# EAGLE design Bus Stop Kiosk Rev. 1 (EAGLE 7.3.0)
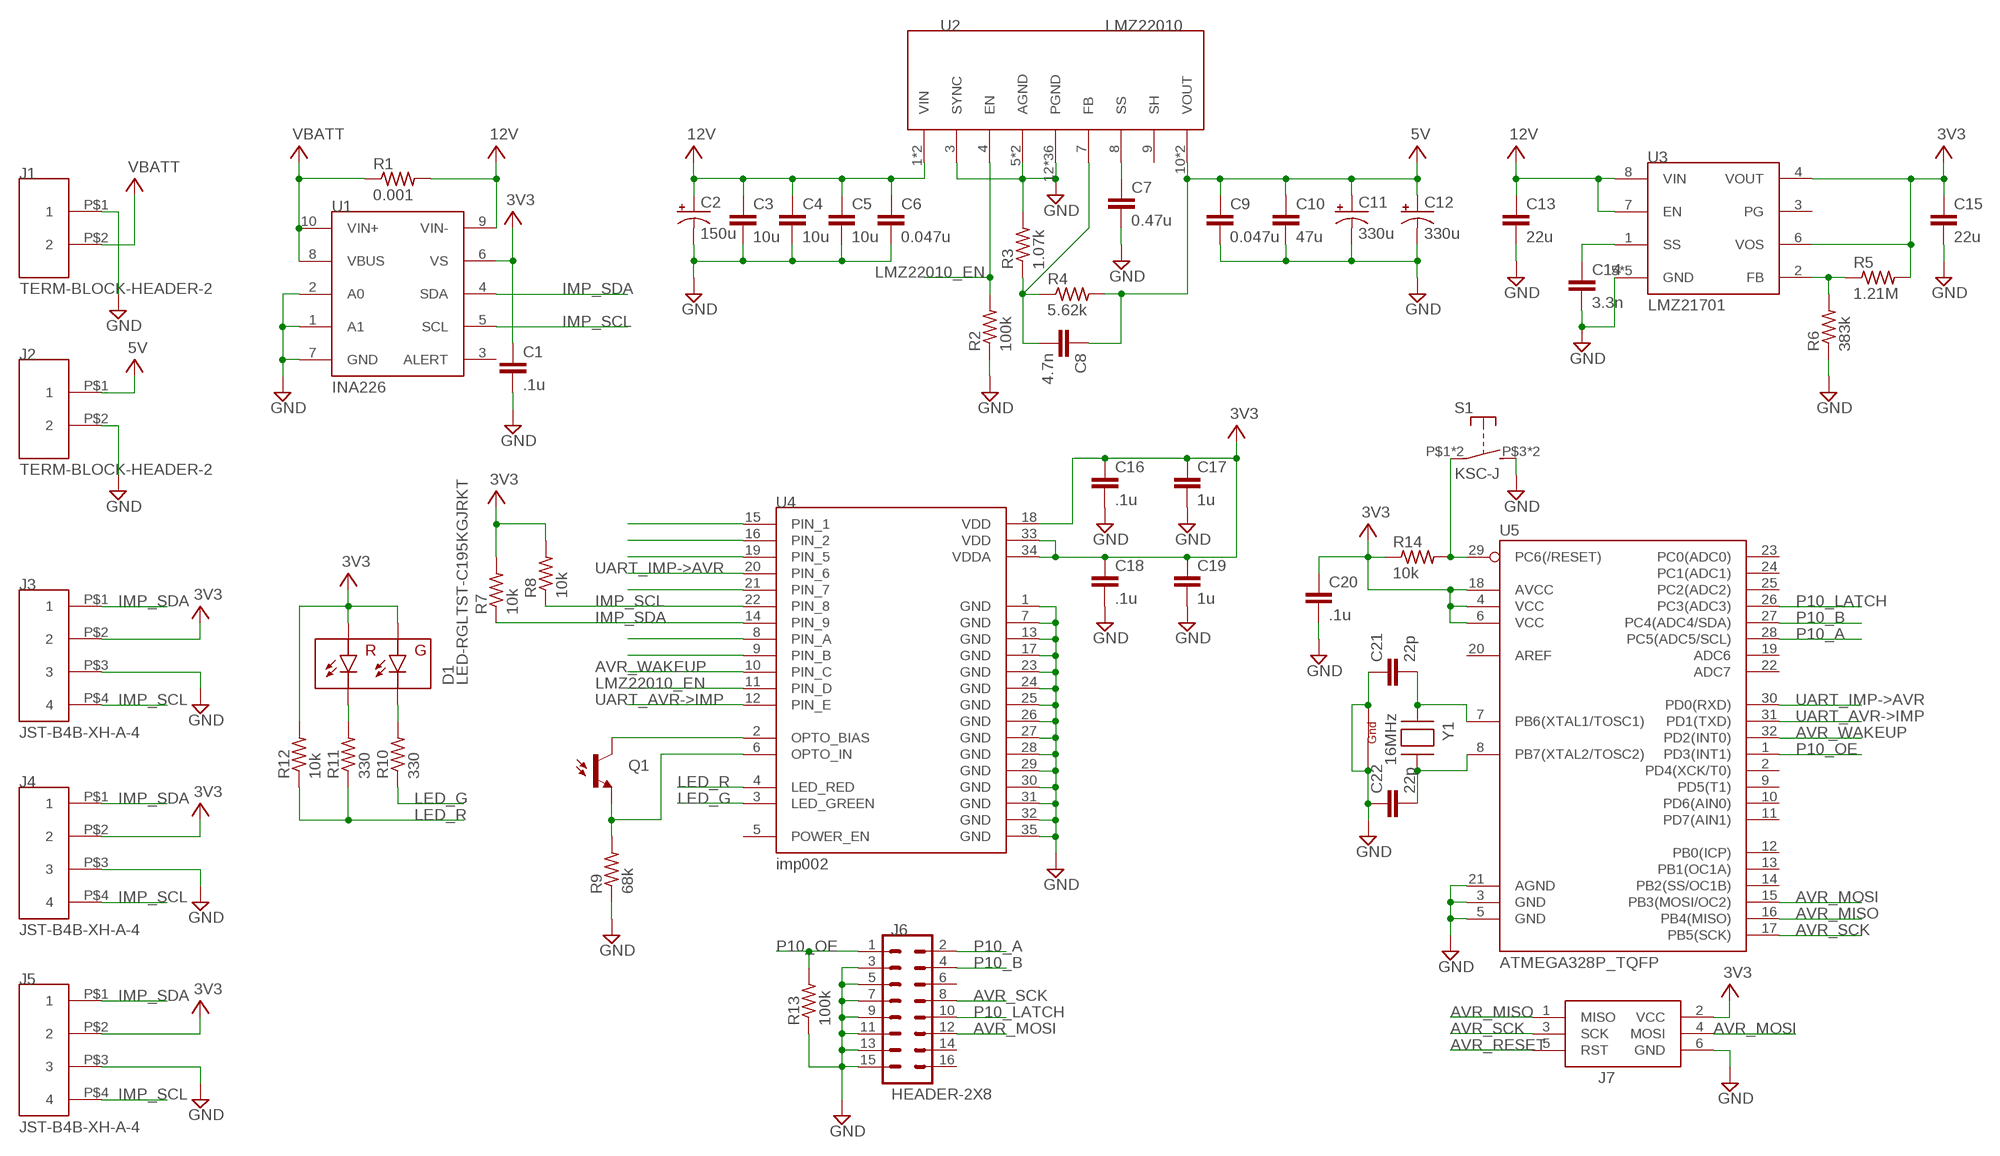
[diagram p0: schematic, sheet 1]

## Parts
C1  .1u  C-EUC0603K  [C0603K]
C2  150u  CAP_POLG  [PANASONIC_G]
C3  10u  C-EUC1210K  [C1210K]
C4  10u  C-EUC1210K  [C1210K]
C5  10u  C-EUC1210K  [C1210K]
C6  0.047u  C-EUC1206K  [C1206K]
C7  0.47u  C-EUC0603K  [C0603K]
C8  4.7n  C-EUC0603K  [C0603K]
C9  0.047u  C-EUC1206K  [C1206K]
C10  47u  C-EUC1210K  [C1210K]
C11  330u  CAP_POL7343  [EIA7343]
C12  330u  CAP_POL7343  [EIA7343]
C13  22u  C-EUC1210K  [C1210K]
C14  3.3n  C-EUC0603K  [C0603K]
C15  22u  C-EUC0805K  [C0805K]
C16  .1u  C-EUC0603K  [C0603K]
C17  1u  C-EUC0603K  [C0603K]
C18  .1u  C-EUC0603K  [C0603K]
C19  1u  C-EUC0603K  [C0603K]
C20  .1u  C-EUC0603K  [C0603K]
C21  22p  C-EUC0603K  [C0603K]
C22  22p  C-EUC0603K  [C0603K]
D1  LED-RGLTST-C195KGJRKT  [LTST-C195KGJRKT]
J1  TERM-BLOCK-HEADER-2  [TERM-BLOCK-HDR-2]
J2  TERM-BLOCK-HEADER-2  [TERM-BLOCK-HDR-2]
J3  JST-B4B-XH-A-4  [JST-B4B-XH-A-4]
J4  JST-B4B-XH-A-4  [JST-B4B-XH-A-4]
J5  JST-B4B-XH-A-4  [JST-B4B-XH-A-4]
J6  HEADER-2X8  [HEADER-2X8-SHROUDED]
J7  AVRISP-6  [AVRISP]
Q1  PHOTOTRANSISTORPT17-21C-L41-TR8  [PT17-21C-L41-TR8]
R1  0.001  R-US_R1206  [R1206]
R2  100k  R-US_R0603  [R0603]
R3  1.07k  R-US_R0603  [R0603]
R4  5.62k  R-US_R0603  [R0603]
R5  1.21M  R-US_R0603  [R0603]
R6  383k  R-US_R0603  [R0603]
R7  10k  R-US_R0603  [R0603]
R8  10k  R-US_R0603  [R0603]
R9  68k  R-US_R0603  [R0603]
R10  330  R-US_R0603  [R0603]
R11  330  R-US_R0603  [R0603]
R12  10k  R-US_R0603  [R0603]
R13  100k  R-US_R0603  [R0603]
R14  10k  R-US_R0603  [R0603]
S1  KSC-J  [C&K-KSC]
U1  INA226  [VSSOP-10]
U2  LMZ22010  [TO-PMOD-11]
U3  LMZ21701  [SIL0008E]
U4  imp002  ELECTRIC_IMP_IMP002  [ELECTRIC_IMP_IMP002]
U5  ATMEGA328P_TQFP  [TQFP32-08]
Y1  16MHz  XTAL-4-3225  [NX3225]

## Nets
3V3: C1.1 C15.1 C16.1 C17.1 C18.1 C19.1 C20.1 D1.P$1(GA) D1.P$2(RA) J3.P$2 J4.P$2 J5.P$2 J7.2(VCC) R5.2 R7.2 R8.2 R12.2 R14.1 U1.6(VS) U3.4(VOUT) U3.6(VOS) U4.18(VDD) U4.33(VDD) U4.34(VDDA) U5.4(VCC) U5.6(VCC) U5.18(AVCC)
5V: C8.1 C9.1 C10.1 C11.A(+) C12.A(+) J2.P$1 R4.2 U2.10(VOUT) U2.11(VOUT)
12V: C2.+ C3.1 C4.1 C5.1 C6.1 C13.1 R1.2 U1.9(VIN-) U2.1(VIN) U2.2(VIN) U3.7(EN) U3.8(VIN)
ADC1: U4.8(PIN_A)
ADC2: U4.9(PIN_B)
AVR_MISO: J7.1(MISO) U5.16(PB4(MISO))
AVR_MOSI: J6.12 J7.4(MOSI) U5.15(PB3(MOSI/OC2))
AVR_RESET: J7.5(RST) R14.2 S1.P$1(P) S1.P$2(P) U5.29(PC6(/RESET))
AVR_SCK: J6.8 J7.3(SCK) U5.17(PB5(SCK))
AVR_WAKEUP: U4.10(PIN_C) U5.32(PD2(INT0))
C21: C21.2 U5.7(PB6(XTAL1/TOSC1)) Y1.1(X1)
GND: C1.2 C2.- C3.2 C4.2 C5.2 C6.2 C7.2 C9.2 C10.2 C11.C(-) C12.C(-) C13.2 C14.2 C15.2 C16.2 C17.2 C18.2 C19.2 C20.2 C21.1 C22.1 J1.P$1 J2.P$2 J3.P$3 J4.P$3 J5.P$3 J6.3 J6.5 J6.7 J6.9 J6.11 J6.13 J6.15 J7.6(GND) R2.1 R3.2 R6.1 R9.1 R13.1 S1.P$3(S) S1.P$4(S) U1.1(A1) U1.2(A0) U1.7(GND) U2.3(SYNC) U2.5(AGND) U2.6(AGND) U2.12(PGND) U2.P$1(PGND) U2.P$2(PGND) U2.P$3(PGND) U2.P$4(PGND) U2.P$5(PGND) U2.P$6(PGND) U2.P$7(PGND) U2.P$8(PGND) U2.P$9(PGND) U2.P$10(PGND) U2.P$11(PGND) U2.P$12(PGND) U2.P$13(PGND) U2.P$14(PGND) U2.P$15(PGND) U2.P$16(PGND) U2.P$17(PGND) U2.P$18(PGND) U2.P$19(PGND) U2.P$20(PGND) U2.P$21(PGND) U2.P$22(PGND) U2.P$23(PGND) U2.P$24(PGND) U2.P$25(PGND) U2.P$26(PGND) U2.P$27(PGND) U2.P$28(PGND) U2.P$29(PGND) U2.P$30(PGND) U2.P$31(PGND) U2.P$32(PGND) U2.P$33(PGND) U2.P$34(PGND) U2.P$35(PGND) U3.5(GND) U3.9(GND) U3.10(GND) U3.11(GND) U3.12(GND) U4.1(GND) U4.7(GND) U4.13(GND) U4.17(GND) U4.23(GND) U4.24(GND) U4.25(GND) U4.26(GND) U4.27(GND) U4.28(GND) U4.29(GND) U4.30(GND) U4.31(GND) U4.32(GND) U4.35(GND) U5.3(GND) U5.5(GND) U5.21(AGND) Y1.2(G2) Y1.4(G1)
IMP_SCL: J3.P$4 J4.P$4 J5.P$4 R8.1 U1.5(SCL) U4.22(PIN_8)
IMP_SDA: J3.P$1 J4.P$1 J5.P$1 R7.1 U1.4(SDA) U4.14(PIN_9)
LED_G: R10.1 U4.3(LED_GREEN)
LED_R: R11.1 R12.1 U4.4(LED_RED)
LMZ22010_EN: R2.2 U2.4(EN) U4.11(PIN_D)
N$1: Q1.C U4.2(OPTO_BIAS)
N$2: Q1.E R9.2 U4.6(OPTO_IN)
N$3: D1.P$3(GC) R10.2
N$4: D1.P$4(RC) R11.2
N$5: C14.1 U3.1(SS)
N$6: U4.21(PIN_7)
N$7: C8.2 R3.1 R4.1 U2.7(FB)
N$8: C7.1 U2.8(SS)
N$9: R5.1 R6.2 U3.2(FB)
N$10: U4.19(PIN_5)
N$11: U4.16(PIN_2)
N$12: U4.15(PIN_1)
N$19: C22.2 U5.8(PB7(XTAL2/TOSC2)) Y1.3(X2)
P10_A: J6.2 U5.28(PC5(ADC5/SCL))
P10_B: J6.4 U5.27(PC4(ADC4/SDA))
P10_LATCH: J6.10 U5.26(PC3(ADC3))
P10_OE: J6.1 R13.2 U5.1(PD3(INT1))
UART_AVR->IMP: U4.12(PIN_E) U5.31(PD1(TXD))
UART_IMP->AVR: U4.20(PIN_6) U5.30(PD0(RXD))
VBATT: J1.P$2 R1.1 U1.8(VBUS) U1.10(VIN+)
Unconnected: J6.6 J6.14 J6.16 U1.3(ALERT) U2.9(SH) U3.3(PG) U4.5(POWER_EN) U5.2(PD4(XCK/T0)) U5.9(PD5(T1)) U5.10(PD6(AIN0)) U5.11(PD7(AIN1)) U5.12(PB0(ICP)) U5.13(PB1(OC1A)) U5.14(PB2(SS/OC1B)) U5.19(ADC6) U5.20(AREF) U5.22(ADC7) U5.23(PC0(ADC0)) U5.24(PC1(ADC1)) U5.25(PC2(ADC2))

## Library data of the parts
C1 C3-C10 C13-C22 = resistor:C-EU: CAPACITOR, European symbol
C2 = SparkFun-Capacitors:CAP_POL: Capacitor Polarized These are standard SMD and PTH capacitors. Normally 10uF, 47uF, and 100uF in electrolytic and tantalum varieties. Always verify the external diameter of the through hole cap, it varies with capacity, voltage, and manufacturer. The EIA devices should be standard.
C11 C12 = SparkFun-Capacitors:CAP_POL: Capacitor Polarized These are standard SMD and PTH capacitors. Normally 10uF, 47uF, and 100uF in electrolytic and tantalum varieties. Always verify the external diameter of the through hole cap, it varies with capacity, voltage, and manufacturer. The EIA devices should be standard.; PROD_ID: CAP-08702
D1 = SparkFun-LED:LED-RG; PROD_ID: DIO-12140
J1 J2 = JL:TERM-BLOCK-HEADER-2
J3-J5 = JL:JST-B4B-XH-A-4
J6 = JL:HEADER-2X8
J7 = adafruit:AVRISP: AVR ISP HEADER Standard 6 pin header for AVR programming
Q1 = SparkFun-DiscreteSemi:PHOTOTRANSISTOR; PROD_ID: TRANS-12141
R1-R14 = resistor:R-US_: RESISTOR, American symbol
S1 = JL:KSC-J
U1 = JL:INA226
U2 = JL:LMZ22010
U3 = JL:LMZ21701
U4 = SparkFun-DigitalIC:ELECTRIC_IMP_IMP002; PROD_ID: IC-12130
U5 = SparkFun-DigitalIC:ATMEGA328P_TQFP; PROD_ID: IC-09069
Y1 = adafruit:XTAL-4: Classic 4-pin 3.2 x 2.5mm crystal

## Board
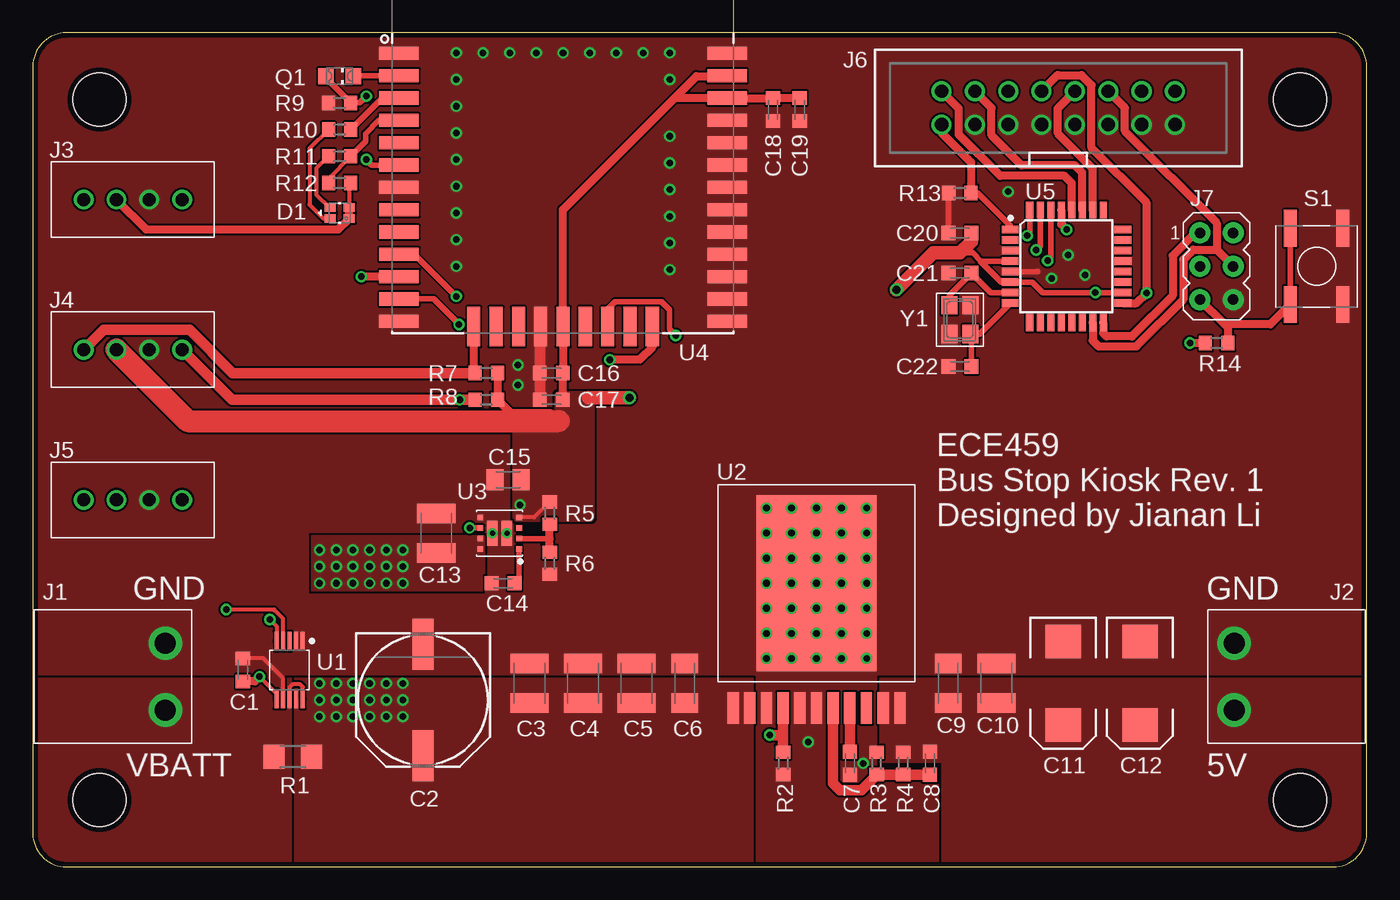
[diagram p1: board, top side]
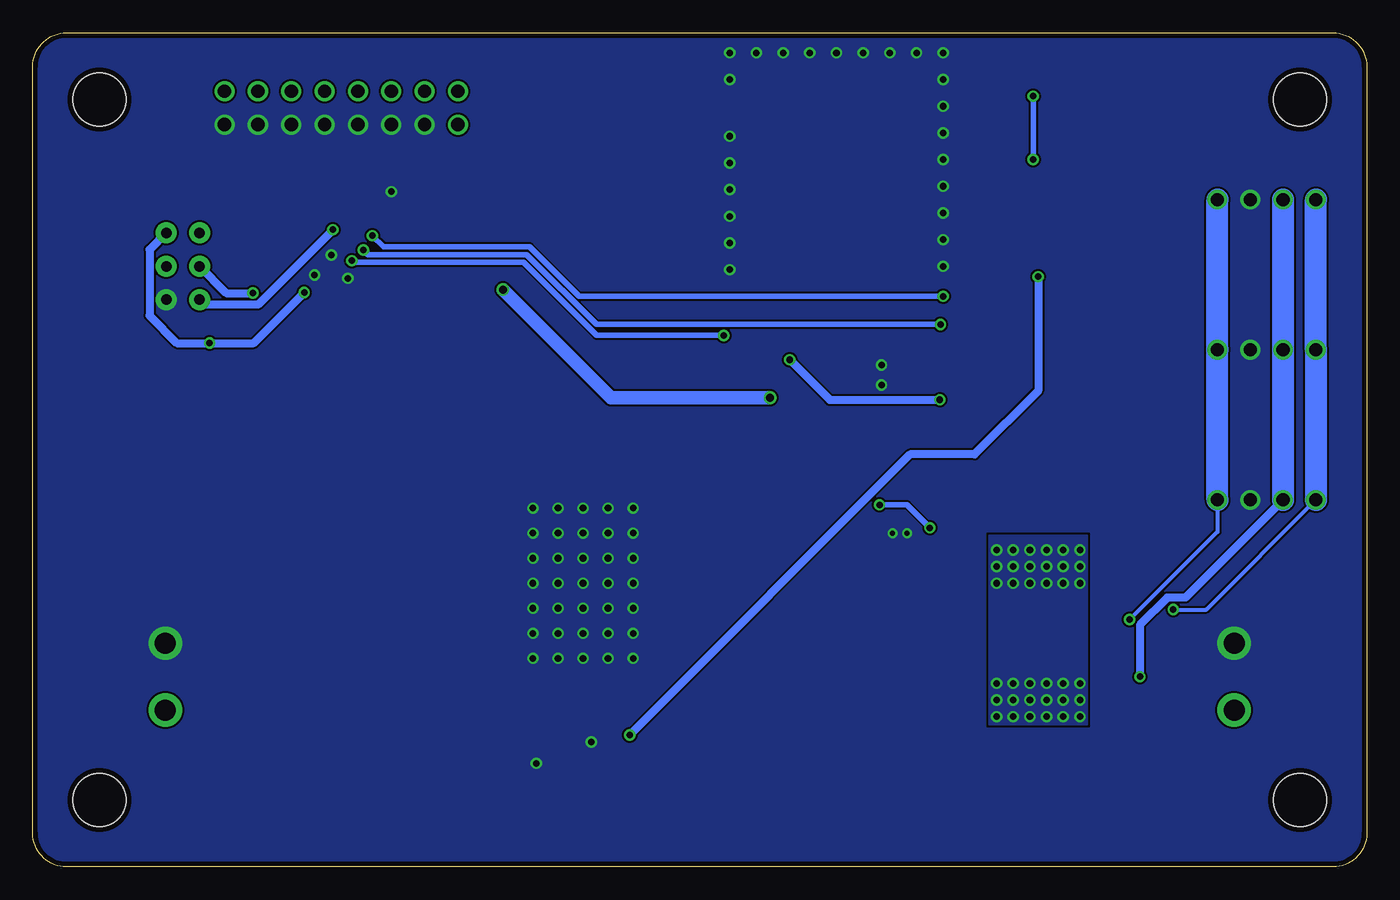
[diagram p2: board, bottom side, seen from below]

Size 101.6 x 63.5 mm. Coordinates in mm from the lower left corner, seen from the top.
Outline: 0,60.96 0,2.54 arc90 2.54,0 99.06,0 arc90 101.6,2.54 101.6,60.96 arc90 99.06,63.5 2.54,63.5 arc90 0,60.96
Copper layers (1*16): Top 0.0356mm / dielectric 1.5011mm / Bottom 0.0356mm
Design rules "LaenPCBOrder *": minimum track width 6mil, minimum drill 15mil, track to track 6mil, track to pad 6mil, pad to pad 6mil, via to via 6mil, smd to smd 6mil, copper to edge 15mil, drill to drill 6mil, minimum pad ring 7mil, minimum via ring 7mil, stop-mask expansion 0mil, vias tented up to drill 40mil, thermal gap 10mil
Holes 4.06 mm at 5.08,5.08 96.52,5.08 96.52,58.42 5.08,58.42

### Footprints (pad centres in the part's own frame; a part is rotated, then mirrored left to right if it is on the bottom)
C0603K = smd 1.05 x 1.08: 1 -0.875,0; 2 0.875,0
PANASONIC_G = smd 3.9 x 1.6: + 4.25,0; - -4.25,0
C1210K = smd 1.5 x 2.9: 1 -1.5,0; 2 1.5,0
C1206K = smd 1.5 x 2: 1 -1.5,0; 2 1.5,0
EIA7343 = smd 2.55 x 2.7: A 3.17,0; C -3.17,0
C0805K = smd 1.3 x 1.6: 1 -1,0; 2 1,0
LTST-C195KGJRKT = smd 0.65 x 0.85: P$1 0.425,0.725; P$2 -0.425,0.725; P$3 0.425,-0.725; P$4 -0.425,-0.725
TERM-BLOCK-HDR-2 = drill 1.6 pad 2.54: P$1 -2.54,4; P$2 2.54,4
JST-B4B-XH-A-4 = drill 1: P$1 -3.75,0; P$2 -1.25,0; P$3 1.25,0; P$4 3.75,0
HEADER-2X8-SHROUDED = drill 1.016: 1 -1.27,8.89; 2 1.27,8.89; 3 -1.27,6.35; 4 1.27,6.35; 5 -1.27,3.81; 6 1.27,3.81; 7 -1.27,1.27; 8 1.27,1.27; 9 -1.27,-1.27; 10 1.27,-1.27; 11 -1.27,-3.81; 12 1.27,-3.81; 13 -1.27,-6.35; 14 1.27,-6.35; 15 -1.27,-8.89; 16 1.27,-8.89
AVRISP = drill 0.8 pad 1.6: 1 -1.27,2.54; 2 1.27,2.54; 3 -1.27,0; 4 1.27,0; 5 -1.27,-2.54; 6 1.27,-2.54
PT17-21C-L41-TR8 = smd 1.2 x 1.2: C 0,1.05; E 0,-1.05
R1206 = smd 1.6 x 1.803: 1 -1.422,0; 2 1.422,0
R0603 = smd 1 x 1.1: 1 -0.85,0; 2 0.85,0
C&K-KSC = smd 2.8 x 1: P$1 -2.9,2; P$2 2.9,2; P$3 -2.9,-2; P$4 2.9,-2
VSSOP-10 = smd 0.3 x 1.45: 1 -1,-2.2; 2 -0.5,-2.2; 3 0,-2.2; 4 0.5,-2.2; 5 1,-2.2; 6 1,2.2; 7 0.5,2.2; 8 0,2.2; 9 -0.5,2.2; 10 -1,2.2
TO-PMOD-11 = smd 0.86 x 2.41: 1 -6.35,-9.5; 2 -5.08,-9.5; 3 -3.81,-9.5; 4 -2.54,-9.5; 5 -1.27,-9.5; 6 0,-9.5; 7 1.27,-9.5; 8 2.54,-9.5; 9 3.81,-9.5; 10 5.08,-9.5; 11 6.35,-9.5 | smd 9.126 x 13.37: 12 0,0 | drill 0.5: P$1 -3.81,5.715; P$2 -1.905,5.715; P$3 0,5.715; P$4 1.905,5.715; P$5 3.81,5.715; P$6 -3.81,3.81; P$7 -1.905,3.81; P$8 0,3.81; P$9 1.905,3.81; P$10 3.81,3.81; P$11 -3.81,1.905; P$12 -1.905,1.905; P$13 0,1.905; P$14 1.905,1.905; P$15 3.81,1.905; P$16 -3.81,0; P$17 -1.905,0; P$18 0,0; P$19 1.905,0; P$20 3.81,0; P$21 -3.81,-1.905; P$22 -1.905,-1.905; P$23 0,-1.905; P$24 1.905,-1.905; P$25 3.81,-1.905; P$26 -3.81,-3.81; P$27 -1.905,-3.81; P$28 0,-3.81; P$29 1.905,-3.81; P$30 3.81,-3.81; P$31 -3.81,-5.715; P$32 -1.905,-5.715; P$33 0,-5.715; P$34 1.905,-5.715; P$35 3.81,-5.715
SIL0008E = smd 0.45 x 0.4: 1 -1.475,1.2; 2 -1.475,0.4; 3 -1.475,-0.4; 4 -1.475,-1.2; 5 1.475,-1.2; 6 1.475,-0.4; 7 1.475,0.4; 8 1.475,1.2 | smd 0.8 x 1.9: 9 -0.55,0; 10 0.55,0 | drill 0.381 pad 0.61: 11 -0.55,0; 12 0.55,0
ELECTRIC_IMP_IMP002 = smd 3 x 1: 1 -12.5,5.8; 2 -12.5,4.1; 3 -12.5,2.4; 4 -12.5,0.7; 5 -12.5,-1; 6 -12.5,-2.7; 7 -12.5,-4.4; 8 -12.5,-6.1; 9 -12.5,-7.8; 10 -12.5,-9.5; 11 -12.5,-11.2; 12 -12.5,-12.9; 13 -12.5,-14.6; 23 12.5,-14.6; 24 12.5,-12.9; 25 12.5,-11.2; 26 12.5,-9.5; 27 12.5,-7.8; 28 12.5,-6.1; 29 12.5,-4.4; 30 12.5,-2.7; 31 12.5,-1; 32 12.5,0.7; 33 12.5,2.4; 34 12.5,4.1; 35 12.5,5.8 | smd 1 x 3: 14 -6.8,-15; 15 -5.1,-15; 16 -3.4,-15; 17 -1.7,-15; 18 0,-15; 19 1.7,-15; 20 3.4,-15; 21 5.1,-15; 22 6.8,-15
TQFP32-08 = smd 1.27 x 0.559: 1 -4.293,2.8; 2 -4.293,2; 3 -4.293,1.2; 4 -4.293,0.4; 5 -4.293,-0.4; 6 -4.293,-1.2; 7 -4.293,-2; 8 -4.293,-2.8; 17 4.293,-2.8; 18 4.293,-2; 19 4.293,-1.2; 20 4.293,-0.4; 21 4.293,0.4; 22 4.293,1.2; 23 4.293,2; 24 4.293,2.8 | smd 0.559 x 1.27: 9 -2.8,-4.293; 10 -2,-4.293; 11 -1.2,-4.293; 12 -0.4,-4.293; 13 0.4,-4.293; 14 1.2,-4.293; 15 2,-4.293; 16 2.8,-4.293; 25 2.8,4.293; 26 2,4.293; 27 1.2,4.293; 28 0.4,4.293; 29 -0.4,4.293; 30 -1.2,4.293; 31 -2,4.293; 32 -2.8,4.293
NX3225 = smd 1.4 x 1.2: 1 -1.1,-0.8; 2 1.1,-0.8; 3 1.1,0.8; 4 -1.1,0.8

### Placement (x,y rotation side)
C1  16,14.99 90 top
C2  29.72,12.7 270 top
C3  37.85,13.97 90 top
C4  41.91,13.97 90 top
C5  45.97,13.97 90 top
C6  49.66,13.97 90 top
C7  62.23,7.87 270 top
C8  68.33,7.87 270 top
C9  69.72,13.97 90 top
C10  73.41,13.97 90 top
C11  78.49,13.97 270 top
C12  84.33,13.97 270 top
C13  30.73,25.4 90 top
C14  35.81,21.59 180 top
C15  36.2,29.46 180 top
C16  39.5,37.59 180 top
C17  39.5,35.56 180 top
C18  56.39,57.66 270 top
C19  58.42,57.66 270 top
C20  70.61,48.26 180 top
C21  70.61,45.21 0 top
C22  70.61,38.1 0 top
D1  23.37,49.78 270 top
J1  6.1,14.48 270 top
J2  95.5,14.48 90 top
J3  7.62,50.8 0 top
J4  7.62,39.37 0 top
J5  7.62,27.94 0 top
J6  78.11,57.78 90 top
J7  90.17,45.72 0 top
Q1  23.37,60.2 270 top
R1  19.81,8.38 0 top
R2  57.15,7.87 90 top
R3  64.26,7.87 90 top
R4  66.29,7.87 90 top
R5  39.37,26.92 90 top
R6  39.37,23.11 90 top
R7  34.54,37.59 0 top
R8  34.54,35.56 0 top
R9  23.37,58.17 0 top
R10  23.37,56.13 180 top
R11  23.37,54.1 180 top
R12  23.37,52.07 0 top
R13  70.61,51.31 0 top
R14  90.17,39.88 0 top
S1  97.79,45.72 90 top
U1  19.56,14.99 180 top
U2  59.69,21.59 0 top
U3  35.56,25.4 180 top
U4  40.39,56.13 0 top
U5  78.74,45.72 0 top
Y1  70.61,41.66 270 top

### Tracks (layer width: path | path; a pad name or v marks a point on that pad's centre or on a via)
3V3  (via drill 0.5, 0.6)
  Top 0.305: R12.2 24.09,51.95 D1.P$2 | R5.2 38.2,26.6 U3.4 | U1.6 18.56,13.19 v17.27,14.48
  Top 0.406: U5.18 v80.92,43.72 76.93,43.72 76.13,44.52 U5.6 73.77,44.52 72.19,46.1 72.21,46.12 | U5.4 72.21,46.12 | 72.21,46.12 71.59,46.74 70.61,46.74 | U3.6 v33.28,25.8 v33.27,25.81 | v37.11,27.56 37.21,27.46
  Top 0.61: C19.1 C18.1 U4.33 49.03,58.53 48.96,58.61 | 48.96,58.61 40.39,50.04 U4.18 40.37,41.12 C16.1 C17.1 | 48.96,58.61 50.55,60.2 52.85,60.2 U4.34 | R7.2 R8.2 36.44,34.52 39.47,34.52 40.06,33.93 | R14.1 v88.14,39.88 | D1.P$2 D1.P$1 23.27,48.54 8.63,48.54 J3.P$2 | v17.27,14.48 16.91,14.11 C1.1
  Top 1.016: C20.1 71.49,47.61 70.61,46.74 68.58,46.74 v65.79,43.94 | v45.44,35.71 42.32,35.71
  Top 1.676: J4.P$2 11.81,33.93 40.06,33.93
  Bottom 0.406: v33.27,25.81 35.03,27.56 v37.11,27.56
  Bottom 0.61: J7.2 92.71,46.99 92.71,41.96 90.63,39.88 v88.14,39.88 84.77,39.88 v80.92,43.72 | J5.P$2 13.81,20.5 15.19,20.5 17.27,18.41 v17.27,14.48
  Bottom 1.016: v65.79,43.94 57.56,35.71 v45.44,35.71
  Bottom 1.676: J3.P$2 J4.P$2 J5.P$2
  pour Top (no thermals): 36.91,34.42 40.13,34.42 40.13,35.81 42.42,35.81 42.42,26.67 36.91,26.67
5V
  pour Top (no thermals): 64.54,14.35 101.24,14.35 101.24,0.25 69.24,0.25 69.24,7.95 64.54,7.95
12V  (via drill 0.5)
  other vias: 21.84,13.97 23.11,13.97 24.38,13.97 25.65,13.97 26.92,13.97 28.19,13.97 21.84,12.7 23.11,12.7 24.38,12.7 25.65,12.7 26.92,12.7 28.19,12.7 21.84,11.43 23.11,11.43 24.38,11.43 25.65,11.43 26.92,11.43 28.19,11.43 21.84,21.59 23.11,21.59 24.38,21.59 25.65,21.59 26.92,21.59 28.19,21.59 28.19,22.86 28.19,24.13 26.92,22.86 25.65,22.86 24.38,22.86 23.11,22.86 21.84,22.86 21.84,24.13 23.11,24.13 24.38,24.13 25.65,24.13 26.92,24.13
  pour Top (rank 2, no thermals): 54.84,14.35 19.94,14.35 19.94,0.25 54.84,0.25
  pour Bottom (no thermals): 21.34,25.15 28.7,25.15 28.7,10.92 21.34,10.92
  pour Top (no thermals): 21.34,25.15 34.29,25.15 34.29,21.08 21.34,21.08
AVR_MISO
  Top 0.61: U5.16 81.54,40.63 81.79,40.39 83.72,40.39 86.82,43.48 86.82,46.53 88.54,48.26 J7.1
AVR_MOSI
  Top 0.61: U5.15 80.74,40.06 81.18,39.62 84.07,39.62 87.63,43.18 87.63,46.23 88.39,46.99 90.17,46.99 | J6.12 83.19,57.78 83.19,56.01 90.17,49.02 90.17,46.99 | 90.17,46.99 J7.4
AVR_RESET  (via drill 0.5)
  Top 0.406: S1.P$2 S1.P$1
  Top 0.61: U5.29 78.34,48.91 v78.74,48.51 | J7.5 90.78,41.3 | 90.78,41.3 91.02,41.06 R14.2 | S1.P$1 94.27,41.3 90.78,41.3
  Bottom 0.61: v78.74,48.51 84.45,42.8 88.52,42.8 J7.5
AVR_SCK  (via drill 0.5)
  Top 0.61: J6.8 78.05,60.27 79.88,60.27 80.64,59.51 80.64,54.74 84.84,50.55 v84.84,43.69 84.07,42.92 U5.17
  Bottom 0.61: J7.3 86.87,43.69 v84.84,43.69
AVR_WAKEUP  (via drill 0.5)
  Top 0.406: U4.10 29.06,46.63 v32.26,43.43 | v75.74,48.06 75.94,48.25 U5.32
  Bottom 0.406: v32.26,43.43 59.99,43.43 63.75,47.19 74.88,47.19 v75.74,48.06
C21
  Top 0.406: U5.7 72.98,43.72 C21.2 69.81,43.54 Y1.1
GND  (via drill 0.5)
  Top 0.305: U1.7 19.06,14.34 17.53,15.88 16.02,15.88 C1.2
  Top 0.406: R13.1 69.74,51.28 C20.2 | U5.5 76.56,45.32 76.56,45.36 | U5.3 74.37,46.92
  Top 0.813: U4.17 38.62,41.07 C16.2 C17.2
  other vias: 40.39,61.98 38.35,61.98 36.32,61.98 34.29,61.98 32.26,61.98 42.42,61.98 44.45,61.98 46.48,61.98 48.51,61.98 32.26,59.94 32.26,57.91 32.26,55.88 32.26,53.85 32.26,51.82 32.26,49.78 32.26,47.75 32.26,45.72 48.51,59.94 48.51,55.63 48.51,53.59 48.51,51.56 48.51,49.53 48.51,47.5 48.51,45.47 63.25,7.87 59.05,9.5 74.3,51.41 36.96,38.2 36.96,36.68 77.6,44.81 80.14,45.06 78.87,46.58
  pour Top (rank 3, no thermals): -1.27,64.77 102.87,64.77 102.87,-1.27 -1.27,-1.27
  pour Bottom (rank 2, no thermals): -2.54,66.04 104.14,66.04 104.14,-2.54 -2.54,-2.54
IMP_SCL  (via drill 0.5)
  Top 0.305: v18.06,18.82 18.56,18.32 U1.5
  Top 0.61: U4.22 47.19,39.57 46.23,38.61 v43.94,38.61
  Top 0.813: R8.1 v32.51,35.56 18.19,35.56 17.72,35.56 15.18,35.56 J4.P$4
  Bottom 0.305: J5.P$4 11.37,25.51 v18.06,18.82
  Bottom 0.61: v43.94,38.61 40.89,35.56 v32.51,35.56
  Bottom 1.676: J5.P$4 J4.P$4 J3.P$4
IMP_SDA  (via drill 0.5)
  Top 0.305: U1.4 19.06,18.89 18.41,19.53 18.41,19.56 18.39,19.58 v14.73,19.58
  Top 0.61: U4.14 33.59,37.7 R7.1
  Top 0.813: R7.1 15.24,37.59 11.94,40.89 5.39,40.89 J4.P$1
  Bottom 0.305: v14.73,19.58 12.23,19.58 J5.P$1
  Bottom 1.676: J3.P$1 J4.P$1 J5.P$1
LED_G
  Top 0.406: R10.1 26.62,58.53 U4.3
LED_R
  Top 0.305: R11.1 22.52,52.4 R12.1
  Top 0.406: R11.1 25.35,55.23 25.35,55.83 26.35,56.83 U4.4
LMZ22010_EN  (via drill 0.5)
  Top 0.61: U4.11 v25.02,44.93
  Top 0.813: U2.4 57.15,10.03 | 57.15,10.03 R2.2 | v56.13,10.03 57.15,10.03
  Bottom 0.61: v56.13,10.03 34.77,31.39 29.87,31.39 25.02,36.25 v25.02,44.93
N$1
  Top 0.406: U4.2 24.45,60.23
  Top 0.61: 24.45,60.23 Q1.C
  Top 1.016: 24.42,60.23 Q1.C
N$2  (via drill 0.5)
  Top 0.406: 22.32,60.07 R9.2 24.89,58.17 v25.4,58.67 | v25.4,53.85 25.81,53.43 U4.6
  Top 0.61: Q1.E 22.32,60.07
  Bottom 0.406: v25.4,58.67 v25.4,53.85
N$3
  Top 0.305: R10.2 21.08,54.7 21.08,50.42 22.14,49.36 D1.P$3
N$4
  Top 0.305: R11.2 21.59,53.17 21.59,51.18 22.56,50.21 D1.P$4
N$5
  Top 0.406: C14.1 37.03,21.94 U3.1
N$7
  Top 0.813: U2.7 60.96,6.35 61.47,5.84 63.12,5.84 64.26,6.99 R3.1 R4.1 66.29,7 C8.2
N$8
  Top 0.813: U2.8 C7.1
N$9
  Top 0.406: U3.2 39.37,24.99
  Top 0.61: R6.2 39.37,24.99 R5.1
N$19
  Top 0.406: U5.8 72.08,40.56 Y1.3 71.49,40.48 C22.2
P10_A
  Top 0.61: J6.2 70.54,57.73 70.54,55.75 73.69,52.6 78.59,52.6 79.14,52.05 U5.28
P10_B
  Top 0.61: J6.4 73.03,57.78 73.03,55.7 75.31,53.42 79.38,53.42 79.94,52.85 U5.27
P10_LATCH
  Top 0.61: J6.10 78.07,57.75 78.08,57.75 78.08,55.83 80.74,53.17 U5.26
P10_OE
  Top 0.406: R13.2 71.93,51.31 74.45,48.79 U5.1
  Top 0.61: J6.1 69.22,55.91 71.46,53.66 R13.2
UART_AVR->IMP  (via drill 0.5)
  Top 0.406: U4.12 30.53,43.23 v32.46,41.3 | v76.43,46.97 76.74,47.28 U5.31
  Bottom 0.406: v32.46,41.3 58.67,41.3 63.98,46.61 76.07,46.61 v76.43,46.97
UART_IMP->AVR  (via drill 0.5)
  Top 0.406: U5.30 77.54,46.4 v77.29,46.15 | U4.20 43.79,42.47 44.35,43.03 47.9,43.03 48.51,42.42 48.51,40.92 v48.97,40.46
  Bottom 0.406: v48.97,40.46 58.65,40.46 64.21,46.02 77.17,46.02 v77.29,46.15
VBATT
  Top 0.305: U1.8 19.56,13.66 19.79,13.89 20.37,13.89 20.56,13.71 U1.10
  pour Top (no thermals): 0.25,14.35 19.68,14.35 19.68,0.25 0.25,0.25

### Text on the board
tPlace: ECE459 / Bus Stop Kiosk Rev. 1 / Designed by Jianan Li | GND | GND | VBATT | 5V